# EAGLE design automaton (EAGLE 6.3)
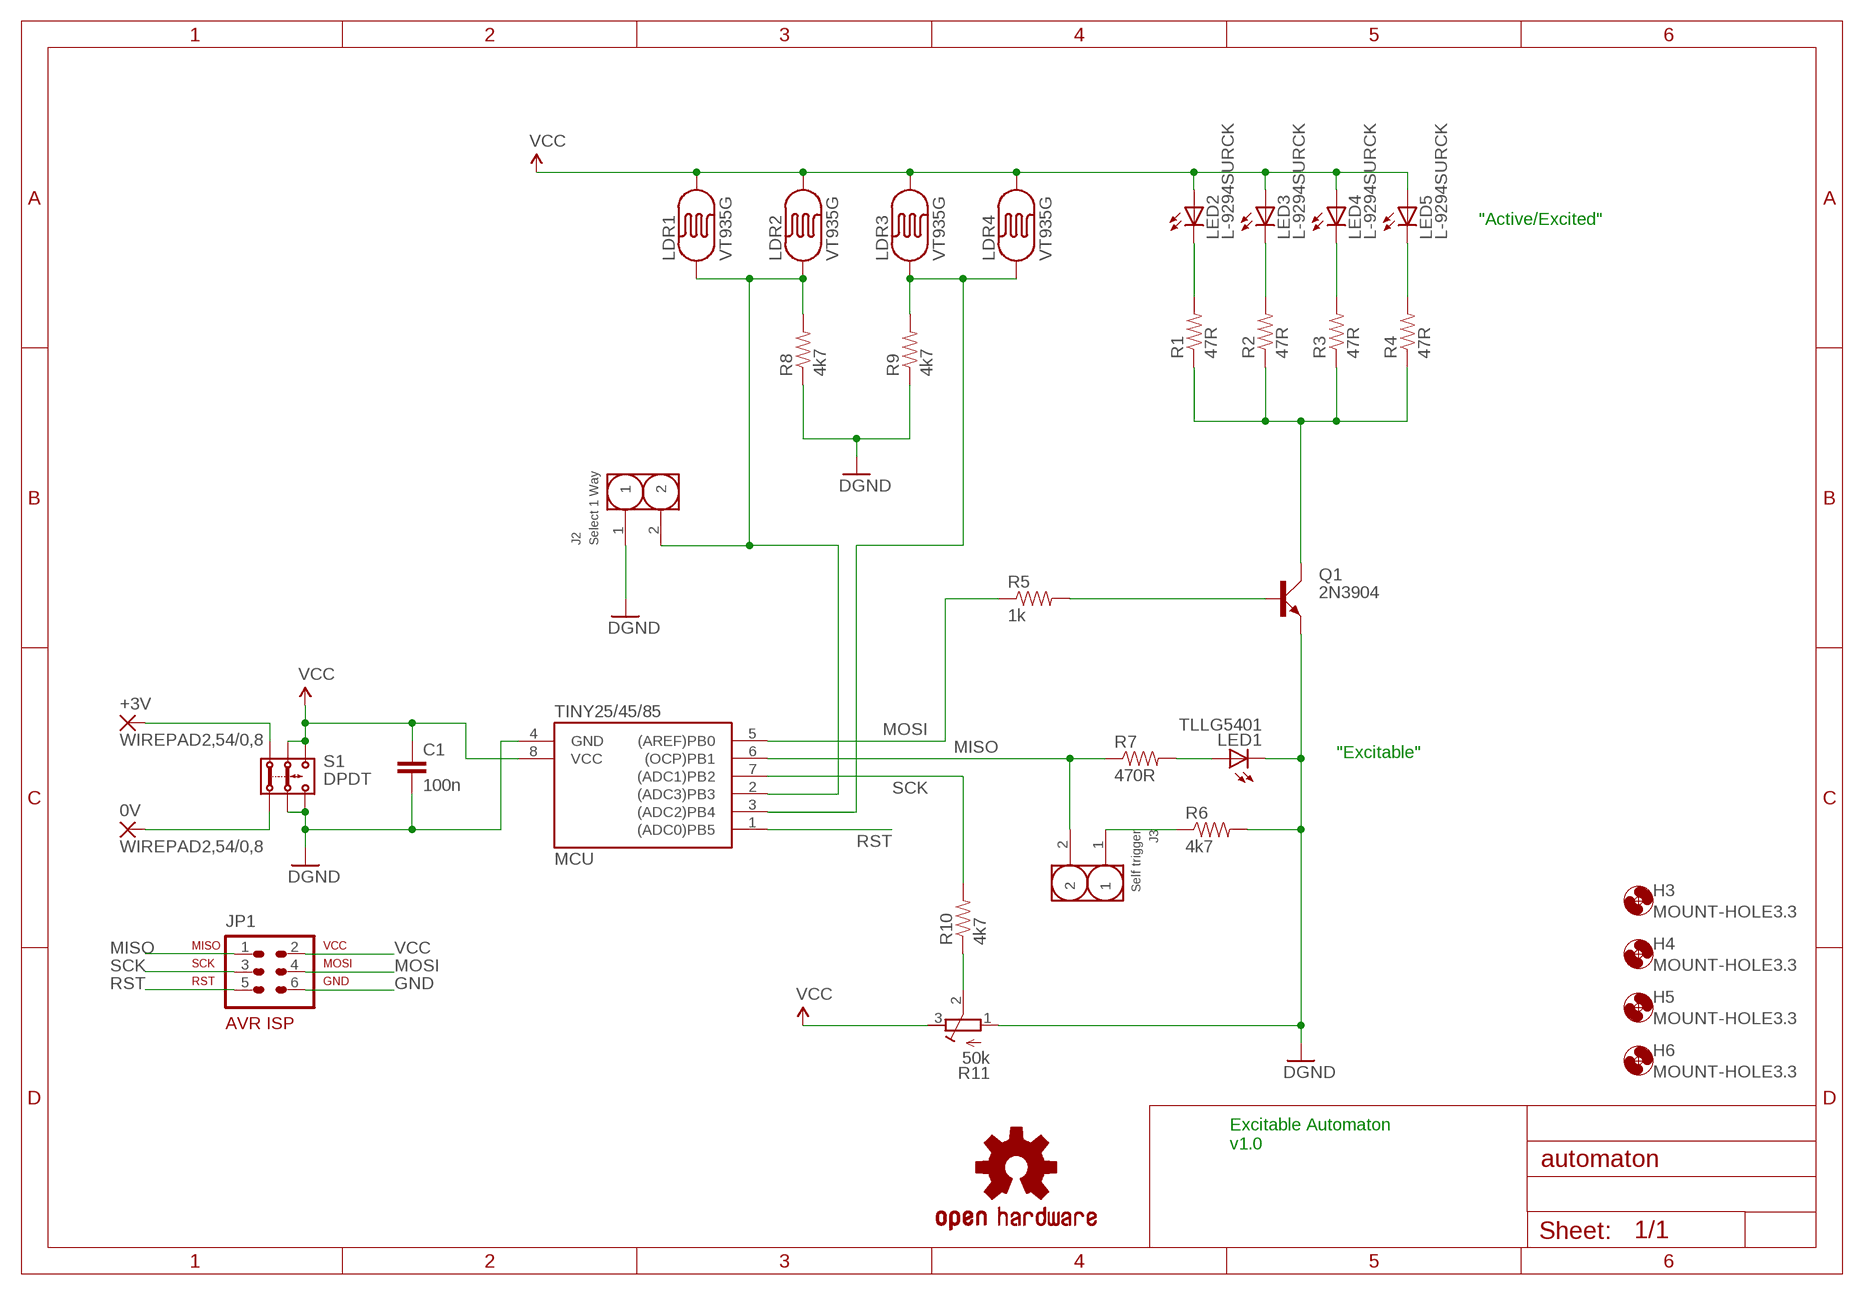
[diagram p0: schematic, sheet 1]

## Parts
0V  WIREPAD2,54/0,8  [2,54/0,8]
+3V  WIREPAD2,54/0,8  [2,54/0,8]
C1  100n  C10/4  [C10B4]
H3  MOUNT-HOLE3.3  [3,3]
H4  MOUNT-HOLE3.3  [3,3]
H5  MOUNT-HOLE3.3  [3,3]
H6  MOUNT-HOLE3.3  [3,3]
J2  Select 1 Way  HEADER-2P-2.54  [2P-2.54]
J3  Self trigger  HEADER-2P-2.54  [2P-2.54]
JP1  AVR-ISP-6VERT  [AVR-ISP-6]
LDR1  VT935G  PHOTOCELLPTH  [PHOTOCELL]
LDR2  VT935G  PHOTOCELLPTH  [PHOTOCELL]
LDR3  VT935G  PHOTOCELLPTH  [PHOTOCELL]
LDR4  VT935G  PHOTOCELLPTH  [PHOTOCELL]
LED1  TLLG5401  LED5MM  [LED5MM]
LED2  L-9294SURCK  LED5MM  [LED5MM]
LED3  L-9294SURCK  LED5MM  [LED5MM]
LED4  L-9294SURCK  LED5MM  [LED5MM]
LED5  L-9294SURCK  LED5MM  [LED5MM]
LOGO1  OSHW-LOGOS  [OSHW-LOGO-S]
MCU  TINY25/45/85  [DIL08]
Q1  2N3904  [TO92D]
R1  47R  RESISTORAXIAL-0.3  [AXIAL-0.3]
R2  47R  RESISTORAXIAL-0.3  [AXIAL-0.3]
R3  47R  RESISTORAXIAL-0.3  [AXIAL-0.3]
R4  47R  RESISTORAXIAL-0.3  [AXIAL-0.3]
R5  1k  RESISTORAXIAL-0.3  [AXIAL-0.3]
R6  4k7  RESISTORAXIAL-0.3  [AXIAL-0.3]
R7  470R  RESISTORAXIAL-0.3  [AXIAL-0.3]
R8  4k7  RESISTORAXIAL-0.3  [AXIAL-0.3]
R9  4k7  RESISTORAXIAL-0.3  [AXIAL-0.3]
R10  4k7  RESISTORAXIAL-0.3  [AXIAL-0.3]
R11  50k  R-TRIMM3296Y  [RTRIM3296Y]
S1  DPDT  2P2T  [2P2T]

## Nets
GND: C1.2 J2.1 JP1.6 LED1.K(C) MCU.4(GND) Q1.E R6.P$2 R8.P$1 R9.P$1 R11.1(E) S1.2.2 S1.3.2 ; supply symbol labelled DGND
MISO: J3.2 JP1.1 MCU.6((OCP)PB1) R7.P$1
MOSI: JP1.4 MCU.5((AREF)PB0) R5.P$1
N$1: J2.2 LDR1.1 LDR2.1 MCU.2((ADC3)PB3) R8.P$2
N$2: LED5.K(C) R4.P$2
N$3: LED2.K(C) R1.P$2
N$4: LED3.K(C) R2.P$2
N$5: LED4.K(C) R3.P$2
N$6: Q1.C R1.P$1 R2.P$1 R3.P$1 R4.P$1
N$7: Q1.B R5.P$2
N$8: 0V.1(P) S1.1.2
N$9: +3V.1(P) S1.1.1
N$10: J3.1 R6.P$1
N$11: R10.P$1 R11.2(S)
N$12: LED1.A R7.P$2
N$13: LDR3.1 LDR4.1 MCU.3((ADC2)PB4) R9.P$2
RST: JP1.5 MCU.1((ADC0)PB5)
SCK: JP1.3 MCU.7((ADC1)PB2) R10.P$2
VCC: C1.1 JP1.2 LDR1.2 LDR2.2 LDR3.2 LDR4.2 LED2.A LED3.A LED4.A LED5.A MCU.8(VCC) R11.3(A) S1.2.1 S1.3.1

## Notes on the sheet
- "Active/Excited"
- "Excitable"
- Excitable Automaton
  v1.0

## Library data of the parts
0V +3V = wirepad:WIREPAD: Wire PAD connect wire on PCB
C1 = capacitor-wima:C: CAPACITOR naming: grid - package width
H3-H6 = holes:MOUNT-HOLE: MOUNTING HOLE with drill center marker
J2 J3 = Connector:HEADER-2P
JP1 = avr-7:AVR-ISP-6: AVR ISP-6 Serial Programming Header
LDR1-LDR4 = automaton parts:PHOTOCELL: CdS photoresistor. This is a low cost way to detect light levels. Resistance decreases with more incoming light. SparkFun SKU: SEN-09088
LED1-LED5 = led:LED: LED OSRAM: - CHIPLED LG R971, LG N971, LY N971, LG Q971, LY Q971, LO R971, LY R971 LH N974, LH R974 LS Q976, LO Q976, LY Q976 LO Q996 - Hyper CHIPLED LW Q18S LB Q993, LB Q99A, LB R99A - SideLED LS A670, LO A670, LY A670, LG A670, LP A670 LB A673, LV A673, LT A673, LW A673 LH A674 LY A675 LS A676, LA A676, LO A676, LY A676, LW A676 LS A679, LY A679, LG A679 - Hyper Micro SIDELED® LS Y876, LA Y876, LO Y876, LY Y876 LT Y87S - SmartLED LW L88C, LW L88S LB L89C, LB L89S, LG L890 LS L89K, LO L89K, LY L89K LS L896, LA L896, LO L896, LY L896 - TOPLED LS T670, LO T670, LY T670, LG T670, LP T670 LSG T670, LSP T670, LSY T670, LOP T670, LYG T670 LG T671, LOG T671, LSG T671 LB T673, LV T673, LT T673, LW T673 LH T674 LS T676, LA T676, LO T676, LY T676, LB T676, LH T676, LSB T676, LW T676 LB T67C, LV T67C, LT T67C, LS T67K, LO T67K, LY T67K, LW E67C LS E67B, LA E67B, LO E67B, LY E67B, LB E67C, LV E67C, LT E67C LW T67C LS T679, LY T679, LG T679 LS T770, LO T770, LY T770, LG T770, LP T770 LB T773, LV T773, LT T773, LW T773 LH T774 LS E675, LA E675, LY E675, LS T675 LS T776, LA T776, LO T776, LY T776, LB T776 LHGB T686 LT T68C, LB T68C - Hyper Mini TOPLED® LB M676 - Mini TOPLED Santana® LG M470 LS M47K, LO M47K, LY M47K Source: http://www.osram.convergy.de LUXEON: - LUMILED® LXK2-PW12-R00, LXK2-PW12-S00, LXK2-PW14-U00, LXK2-PW14-V00 LXK2-PM12-R00, LXK2-PM12-S00, LXK2-PM14-U00 LXK2-PE12-Q00, LXK2-PE12-R00, LXK2-PE12-S00, LXK2-PE14-T00, LXK2-PE14-U00 LXK2-PB12-K00, LXK2-PB12-L00, LXK2-PB12-M00, LXK2-PB14-N00, LXK2-PB14-P00, LXK2-PB14-Q00 LXK2-PR12-L00, LXK2-PR12-M00, LXK2-PR14-Q00, LXK2-PR14-R00 LXK2-PD12-Q00, LXK2-PD12-R00, LXK2-PD12-S00 LXK2-PH12-R00, LXK2-PH12-S00 LXK2-PL12-P00, LXK2-PL12-Q00, LXK2-PL12-R00 Source: www.luxeon.com KINGBRIGHT: KA-3528ASYC Source: www.kingbright.com
LOGO1 = SparkFun-Aesthetics:OSHW-LOGO: Open Source Hardware Logo This logo indicates the piece of hardware it is found on incorporates a OSHW license and/or adheres to the definition of open source hardware found here: http://freedomdefined.org/OSHW
MCU = avr-7:TINY25/45/85
Q1 = transistor-small-signal:2N3904: NPN TRANSISTOR
R1-R10 = SparkFun-Resistors:RESISTOR: Resistor Basic schematic elements and footprints for 0603, 1206, and PTH resistors.
R11 = automaton parts:R-TRIMM: Trimm resistor
S1 = automaton parts:2P2T: MULTICOMP MCLSS22

## Board
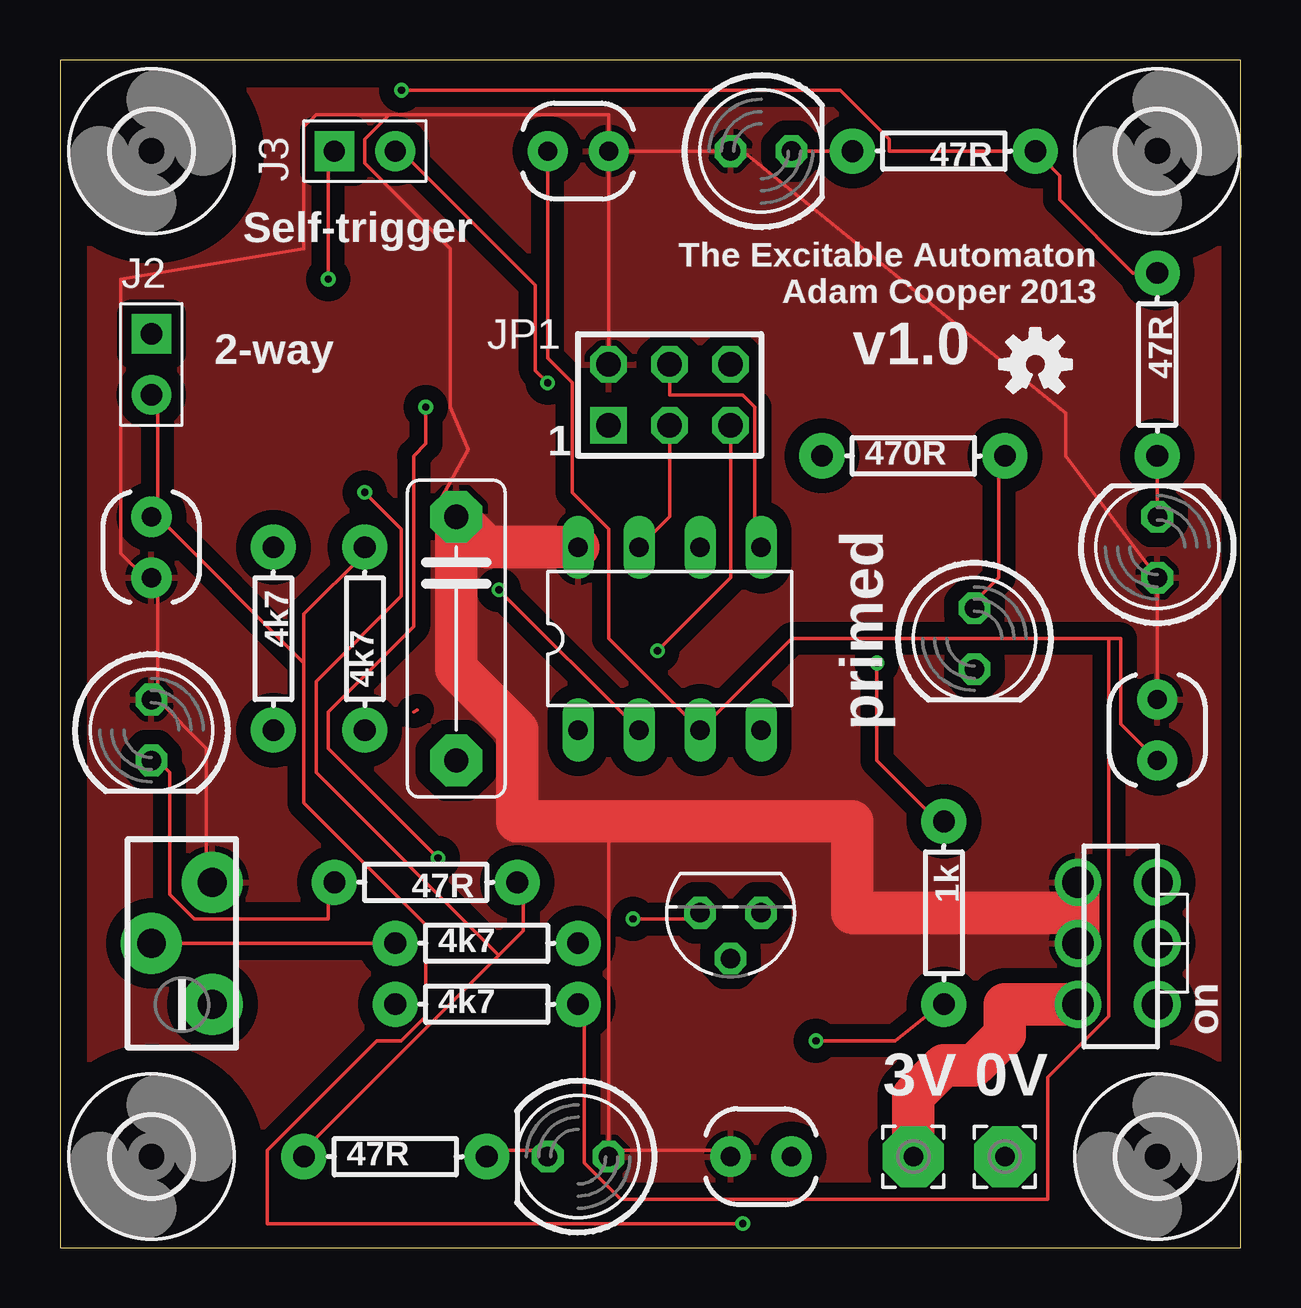
[diagram p1: board, top side]
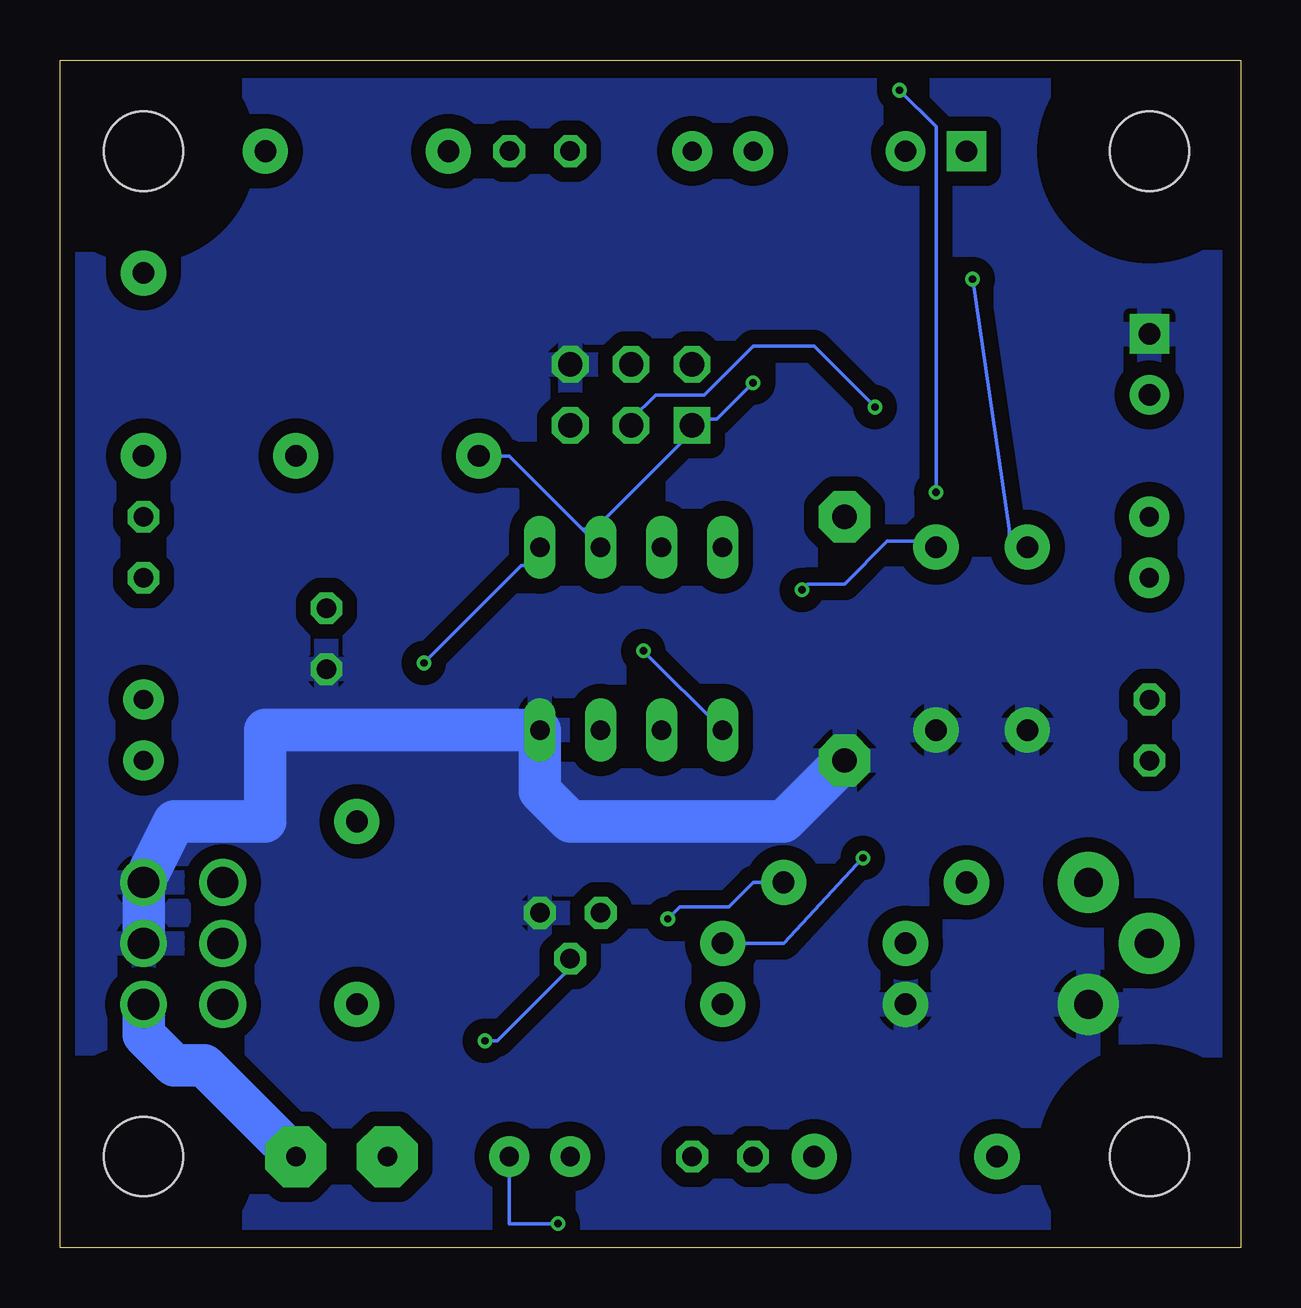
[diagram p2: board, bottom side, seen from below]

Size 49.2 x 49.52 mm. Coordinates in mm from the lower left corner, seen from the top.
Outline: 0,0 49.2,0 49.2,49.52 0,49.52 0,0
Copper layers (1*16): Top 0.035mm / dielectric 1.5mm / Bottom 0.035mm
Design rules "Fusion_eagle_rule_v1.1": minimum track width 6mil, minimum drill 12mil, track to track 6mil, track to pad 6mil, pad to pad 6mil, via to via 6mil, smd to smd 0mil, copper to edge 10mil, drill to drill 10mil, minimum pad ring 10mil, minimum via ring 6mil, stop-mask expansion 2mil, vias tented up to drill 100mil, thermal gap 10mil

### Footprints (pad centres in the part's own frame; a part is rotated, then mirrored left to right if it is on the bottom)
2,54/0,8 = drill 0.813 pad 2.54 octagon: 1 0,0
C10B4 = drill 1.016 pad 2.159 octagon: 1 -5.08,0; 2 5.08,0
3,3 = hole 3.3: 0,0
2P-2.54 = drill 0.889 pad 1.651 square: 1 0,1.27 | drill 0.889 pad 1.651: 2 0,-1.27
AVR-ISP-6 = drill 1.016 square: 1 -2.54,-1.27 | drill 1.016 octagon: 2 -2.54,1.27; 3 0,-1.27; 4 0,1.27; 5 2.54,-1.27; 6 2.54,1.27
PHOTOCELL = drill 0.8 pad 1.676: 1 -1.27,0; 2 1.27,0
LED5MM = drill 0.813 octagon: A -1.27,0; K 1.27,0
DIL08 = drill 0.813 long: 1 -3.81,-3.81; 2 -1.27,-3.81; 3 1.27,-3.81; 4 3.81,-3.81; 5 3.81,3.81; 6 1.27,3.81; 7 -1.27,3.81; 8 -3.81,3.81
TO92D = drill 0.813 octagon: B 0,1.905; C 1.27,0; E -1.27,0
AXIAL-0.3 = drill 0.9 pad 1.88: P$1 -3.81,0; P$2 3.81,0
RTRIM3296Y = drill 1.2 pad 2.54: 1 1.27,-2.54; 2 -1.27,0; 3 1.27,2.54
2P2T = drill 1.3 pad 1.93: 1.1 -2.54,2.032; 1.2 -2.54,-1.27; 2.1 0,2.032; 2.2 0,-1.27; 3.1 2.54,2.032; 3.2 2.54,-1.27

### Placement (x,y rotation side)
0V  39.37,3.81 0 top
+3V  35.56,3.81 0 top
C1  16.51,25.4 270 top
H3  45.72,3.81 0 top
H4  3.81,3.81 0 top
H5  45.72,45.72 0 top
H6  3.81,45.72 0 top
J2  3.81,36.83 0 top
J3  12.7,45.72 90 top
JP1  25.4,35.56 0 top
LDR1  3.81,29.21 270 top
LDR2  29.21,3.81 180 top
LDR3  21.59,45.72 0 top
LDR4  45.72,21.59 90 top
LED1  38.1,25.4 270 top
LED2  45.72,29.21 90 top
LED3  21.59,3.81 180 top
LED4  3.81,21.59 270 top
LED5  29.21,45.72 0 top
LOGO1  40.64,36.83 0 top
MCU  25.4,25.4 0 top
Q1  27.94,13.97 180 top
R1  45.72,36.83 270 top
R2  13.97,3.81 0 top
R3  15.24,15.24 180 top
R4  36.83,45.72 180 top
R5  36.83,13.97 270 top
R6  8.89,25.4 270 top
R7  35.56,33.02 0 top
R8  12.7,25.4 90 top
R9  17.78,10.16 0 top
R10  17.78,12.7 0 top
R11  5.08,12.7 0 top
S1  44.45,12.7 90 top

### Tracks (layer width: path | path; a pad name or v marks a point on that pad's centre or on a via)
GND
  Bottom 1.778: S1.2.2 S1.3.2 44.45,17.78 40.64,17.78 40.64,21.59 MCU.4 29.21,19.05 27.94,17.78 19.05,17.78 C1.2
  pour Bottom (isolate 0.61): 1.27,48.26 48.26,48.26 48.26,1.27 1.27,1.27
MISO  (via drill 0.3)
  Top 0.152: v20.32,36.07 19.81,36.58 19.81,40.13 14.22,45.72 J3.2
  Bottom 0.152: 27.43,29.97 30.48,33.02 R7.P$1 | 27.43,29.97 MCU.6 | 27.43,29.97 26.92,29.97 22.86,34.04 JP1.1 22.86,34.54 21.84,34.54 v20.32,36.07
MOSI  (via drill 0.3)
  Top 0.152: JP1.4 25.4,35.56 28.45,35.56 28.96,35.05 28.96,29.46 MCU.5 | v34.04,24.38 34.04,20.32 36.58,17.78 R5.P$1
  Bottom 0.152: v34.04,24.38 29.97,28.45 29.46,28.45 28.96,28.96 MCU.5
N$1  (via drill 0.3)
  Top 0.152: 4.06,30.48 4.06,35.56 J2.2 | v18.29,27.43 MCU.2 | v28.45,1.02 8.64,1.02 8.64,4.06 13.21,8.64 14.22,8.64 15.24,9.65 15.24,13.46 10.16,18.54 10.16,24.38 | 10.16,24.38 10.16,26.42 12.7,28.96 R8.P$2 | 10.16,24.38 4.06,30.48 | 4.06,30.48 LDR1.1
  Bottom 0.152: v18.29,27.43 18.03,27.69 16.51,27.69 14.73,29.46 12.7,29.46 R8.P$2 | LDR2.1 30.48,1.02 v28.45,1.02
N$2
  Top 0.152: R4.P$2 LED5.K
N$3
  Top 0.152: R1.P$2 LED2.K
N$4
  Top 0.152: LED3.K 20.32,4.06 17.78,4.06 R2.P$2
N$5
  Top 0.152: LED4.K 4.06,20.32 4.57,19.81 4.57,14.73 5.59,13.72 11.18,13.72 11.18,15.24 R3.P$2
N$6  (via drill 0.3)
  Top 0.152: R1.P$1 44.7,40.64 41.66,43.69 41.66,44.7 R4.P$1 34.54,45.72 34.54,46.23 32.51,48.26 v14.22,48.26 | v23.88,13.72 26.42,13.72 Q1.C | 18.29,12.19 19.3,13.21 19.3,15.24 R3.P$1 | 18.29,12.19 10.16,4.06 R2.P$1 | v12.7,31.5 14.22,29.97 14.22,27.18 10.67,23.62 10.67,19.81 18.29,12.19
  Bottom 0.152: v23.88,13.72 23.37,14.22 21.34,14.22 20.32,15.24 R3.P$1 | v14.22,48.26 12.7,46.74 v12.7,31.5
N$7  (via drill 0.3)
  Top 0.152: v31.5,8.64 34.8,8.64 36.07,9.65 36.58,10.16 R5.P$2
  Bottom 0.152: v31.5,8.64 30.99,8.64 27.94,11.68 Q1.B
N$8
  Bottom 1.778: S1.1.2 45.72,8.89 44.45,7.62 43.18,7.62 0V.1
N$9
  Top 1.778: S1.1.1 39.37,10.16 39.37,8.89 38.1,7.62 36.83,7.62 35.56,6.35 +3V.1
N$10  (via drill 0.3)
  Top 0.152: v11.18,40.39 11.18,45.72 J3.1
  Bottom 0.152: v11.18,40.39 9.65,29.97 9.65,29.46 9.14,29.46 R6.P$1
N$11
  Top 0.152: R11.2 R10.P$1
N$12
  Top 0.152: LED1.A 38.1,26.92 39.12,27.94 39.12,33.02 R7.P$2
N$13
  Top 0.152: 43.69,25.4 44.2,25.4 44.2,21.84 LDR4.1 | 43.69,25.4 30.48,25.4 MCU.3 22.86,25.4 22.86,29.97 21.34,31.5 21.34,36.07 20.32,37.08 LDR3.1 | 43.69,25.4 43.69,9.65 41.15,7.11 41.15,2.03 23.37,2.03 21.84,3.56 21.84,10.16 R9.P$2
N$14
  Top 0.152: 14.73,22.35 14.89,22.42
RST  (via drill 0.3)
  Top 0.152: v24.89,24.89 27.94,27.94 JP1.5
  Bottom 0.152: v24.89,24.89 MCU.1
SCK  (via drill 0.3)
  Top 0.152: MCU.7 25.4,30.48 JP1.3 | v15.75,16.26 11.18,20.83 11.18,22.35 14.73,25.91 14.73,33.02 15.24,33.53 v15.24,35.05
  Bottom 0.152: R10.P$2 19.05,12.7 v15.75,16.26 | v15.24,35.05 17.78,37.59 20.32,37.59 22.35,35.56 24.38,35.56 25.4,34.54 JP1.3
VCC
  Top 0.152: 4.06,22.86 4.06,27.94 LDR1.2 3.56,27.94 2.54,28.96 2.54,40.39 10.16,41.66 10.16,46.74 10.67,47.24 13.72,47.24 | 4.06,22.86 6.1,20.83 6.1,15.24 R11.3 | 4.06,22.86 LED4.A | 22.86,4.06 27.94,4.06 LDR2.2 | 22.86,17.78 22.86,4.06 | 22.86,4.06 LED3.A | LDR4.2 LED2.A 41.91,33.02 41.91,34.8 28.45,45.72 LED5.A LDR3.2 | LDR3.2 JP1.2 | 13.72,47.24 12.7,46.23 12.7,45.21 16.26,41.66 16.26,35.05 17.02,33.27 15.75,30.99 16.26,30.48 C1.1 | 13.72,47.24 22.86,47.24 LDR3.2
  Top 1.778: MCU.8 17.78,29.21 C1.1 16.51,24.13 19.05,21.59 19.05,17.78 22.86,17.78 33.02,17.78 33.02,13.97 42.42,13.97 | 42.42,13.97 S1.3.1 | 42.42,13.97 S1.2.1
  pour Top (isolate 0.61): 1.27,48.26 48.26,48.26 48.26,1.27 1.27,1.27

### Text on the board
tPlace: Self-trigger | The Excitable Automaton / Adam Cooper 2013 | 2-way | v1.0 | 1 | primed | on | 3V | 0V